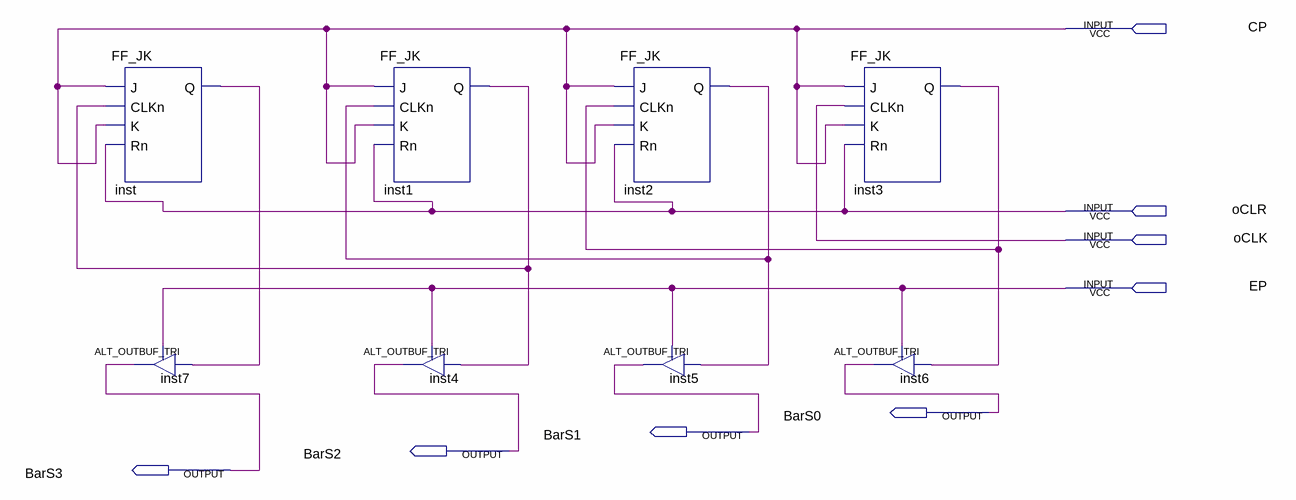
[diagram p0: schematic sheet]
// Quartus schematic Contador_Binario.bdf as structural Verilog: 8 symbols, 8 pins
module Contador_Binario (
  input  CP,
  input  oCLR,
  input  oCLK,
  input  EP,
  output BarS0,
  output BarS1,
  output BarS2,
  output BarS3
);

  wire inst1_q, inst2_q, inst3_q, inst_q;

  FF_JK inst (.J(CP), .CLKn(inst1_q), .K(CP), .Rn(oCLR), .Q(inst_q));
  ALT_OUTBUF_TRI inst7 (.i(inst_q), .oe(EP), .o(BarS3));
  FF_JK inst1 (.J(CP), .CLKn(inst2_q), .K(CP), .Rn(oCLR), .Q(inst1_q));
  ALT_OUTBUF_TRI inst4 (.i(inst1_q), .oe(EP), .o(BarS2));
  FF_JK inst2 (.J(CP), .CLKn(inst3_q), .K(CP), .Rn(oCLR), .Q(inst2_q));
  ALT_OUTBUF_TRI inst5 (.i(inst2_q), .oe(EP), .o(BarS1));
  FF_JK inst3 (.J(CP), .CLKn(oCLK), .K(CP), .Rn(oCLR), .Q(inst3_q));
  ALT_OUTBUF_TRI inst6 (.i(inst3_q), .oe(EP), .o(BarS0));
endmodule
